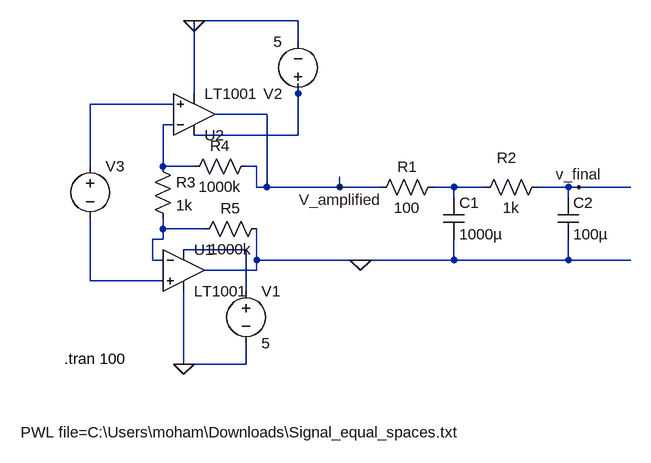
[diagram p0: schematic Processed_Signal_LTspice.asc]
Processed_Signal_LTspice.asc, the LTspice schematic file:
Version 4.1
SHEET 1 984 680
WIRE 400 -176 240 -176
WIRE 400 -144 400 -176
WIRE 240 -64 240 -176
WIRE 400 -64 400 -80
WIRE 208 -48 80 -48
WIRE 352 -32 272 -32
WIRE 208 -16 192 -16
WIRE 400 0 400 -64
WIRE 400 0 240 0
WIRE 80 48 80 -48
WIRE 192 48 192 -16
WIRE 240 48 192 48
WIRE 336 48 320 48
WIRE 336 80 336 48
WIRE 352 80 352 -32
WIRE 352 80 336 80
WIRE 464 80 464 64
WIRE 464 80 352 80
WIRE 528 80 464 80
WIRE 640 80 608 80
WIRE 688 80 640 80
WIRE 816 80 768 80
WIRE 832 80 816 80
WIRE 912 80 832 80
WIRE 640 96 640 80
WIRE 816 96 816 80
WIRE 192 144 192 128
WIRE 256 144 192 144
WIRE 192 160 192 144
WIRE 192 160 176 160
WIRE 320 176 224 176
WIRE 176 192 176 160
WIRE 192 192 176 192
WIRE 336 192 336 144
WIRE 496 192 336 192
WIRE 640 192 640 160
WIRE 640 192 496 192
WIRE 816 192 816 160
WIRE 816 192 640 192
WIRE 912 192 816 192
WIRE 336 208 336 192
WIRE 336 208 256 208
WIRE 80 224 80 128
WIRE 192 224 80 224
WIRE 320 240 320 176
WIRE 224 352 224 240
WIRE 320 352 320 320
WIRE 320 352 224 352
FLAG 464 80 V_amplified
FLAG 224 352 0
FLAG 240 -176 0
FLAG 496 192 0
FLAG 832 80 v_final
SYMBOL res 624 64 R90
WINDOW 0 0 56 VBottom 2
WINDOW 3 32 56 VTop 2
SYMATTR InstName R1
SYMATTR Value 100
SYMBOL cap 624 96 R0
SYMATTR InstName C1
SYMATTR Value 1000µ
SYMBOL res 784 64 R90
WINDOW 0 -14 63 VBottom 2
WINDOW 3 32 56 VTop 2
SYMATTR InstName R2
SYMATTR Value 1k
SYMBOL cap 800 96 R0
SYMATTR InstName C2
SYMATTR Value 100µ
SYMBOL res 176 32 R0
SYMATTR InstName R3
SYMATTR Value 1k
SYMBOL res 336 32 R90
WINDOW 0 0 56 VBottom 2
WINDOW 3 32 56 VTop 2
SYMATTR InstName R4
SYMATTR Value 1000k
SYMBOL res 352 128 R90
WINDOW 0 0 56 VBottom 2
WINDOW 3 32 56 VTop 2
SYMATTR InstName R5
SYMATTR Value 1000k
SYMBOL voltage 320 224 R0
SYMATTR InstName V1
SYMATTR Value 5
SYMBOL voltage 400 -48 R180
WINDOW 123 0 0 Left 0
WINDOW 39 0 0 Left 0
SYMATTR InstName V2
SYMATTR Value 5
SYMBOL OpAmps\\LT1001 240 32 M180
SYMATTR InstName U2
SYMBOL OpAmps\\LT1001 224 144 R0
SYMATTR InstName U1
SYMBOL voltage 80 32 R0
WINDOW 3 -107 425 Left 2
WINDOW 123 0 0 Left 0
WINDOW 39 0 0 Left 0
SYMATTR InstName V3
SYMATTR Value PWL file=C:\Users\moham\Downloads\Signal_equal_spaces.txt
TEXT 40 344 Left 2 !.tran 100

The netlist it stands for:
* Processed_Signal_LTspice.asc
R1 N004 V_amplified 100
C1 N004 0 1000µ
R2 v_final N004 1k
C2 v_final 0 100µ
R3 N003 N005 1k
R4 V_amplified N003 1000k
R5 0 N005 1000k
V1 N006 0 5
V2 N001 0 5
X§U2 N002 N003 N001 0 V_amplified LT1001  ; pins In+ In- V+ V- OUT
X§U1 N007 N005 N006 0 0 LT1001  ; pins In+ In- V+ V- OUT
V3 N002 N007 PWL file=C:\Users\moham\Downloads\Signal_equal_spaces.txt
.tran 100
.lib LTC.lib
.backanno
.end